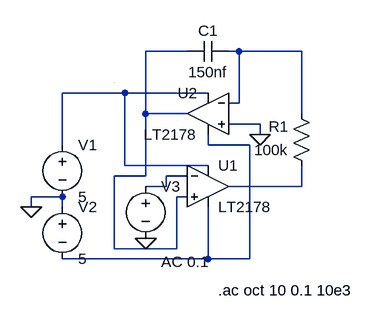
[diagram p0: schematic integrator.asc]
integrator.asc, the LTspice schematic file:
Version 4
SHEET 1 880 680
WIRE 112 -48 48 -48
WIRE 192 -48 176 -48
WIRE 288 -48 192 -48
WIRE 16 16 -80 16
WIRE 144 16 16 16
WIRE 192 32 192 -48
WIRE 192 32 176 32
WIRE 48 48 48 -48
WIRE 112 48 48 48
WIRE 288 48 288 -48
WIRE 224 64 176 64
WIRE 224 80 224 64
WIRE -80 96 -80 16
WIRE 144 96 144 80
WIRE 208 96 144 96
WIRE 16 128 16 16
WIRE 144 128 16 128
WIRE 48 144 48 48
WIRE 48 144 0 144
WIRE 112 144 80 144
WIRE 80 160 80 144
WIRE 80 160 48 160
WIRE 288 160 288 128
WIRE 288 160 176 160
WIRE -80 176 -128 176
WIRE 112 176 96 176
WIRE -128 192 -128 176
WIRE -80 192 -80 176
WIRE 0 256 0 144
WIRE 96 256 96 176
WIRE 96 256 0 256
WIRE 144 272 144 192
WIRE 144 272 -80 272
WIRE 208 272 208 96
WIRE 208 272 144 272
WIRE 0 0 0 0
FLAG 224 80 0
FLAG -128 192 0
FLAG 48 240 0
SYMBOL Opamps\\LT2178 144 96 R0
SYMATTR InstName U1
SYMBOL Opamps\\LT2178 144 -16 M0
SYMATTR InstName U2
SYMBOL res 304 144 R180
WINDOW 0 36 76 Left 0
WINDOW 3 36 40 Left 0
SYMATTR InstName R1
SYMATTR Value 100k
SYMBOL cap 176 -64 R90
WINDOW 0 0 32 VBottom 0
WINDOW 3 32 32 VTop 0
SYMATTR InstName C1
SYMATTR Value 150nf
SYMBOL voltage -80 80 R0
WINDOW 123 0 0 Left 0
WINDOW 39 0 0 Left 0
SYMATTR InstName V1
SYMATTR Value 5
SYMBOL voltage -80 176 R0
WINDOW 123 0 0 Left 0
WINDOW 39 0 0 Left 0
SYMATTR InstName V2
SYMATTR Value 5
SYMBOL voltage 48 144 R0
WINDOW 123 24 132 Left 0
WINDOW 39 0 0 Left 0
SYMATTR InstName V3
SYMATTR Value ""
SYMATTR Value2 AC 0.1
TEXT 160 320 Left 0 !.ac oct 10 0.1 10e3

The netlist it stands for:
* integrator.asc
XU1 N001 N005 N003 N004 N006 LT2178  ; pins In+ In- V+ V- OUT
XU2 0 N002 N003 N004 N001 LT2178  ; pins In+ In- V+ V- OUT
R1 N006 N002 100k
C1 N002 N001 150nf
V1 N003 0 5
V2 0 N004 5
V3 N005 0 AC 0.1
.ac oct 10 0.1 10e3
.backanno
.end